# EAGLE design Traffic_Lights_schematic (EAGLE 8.4.3)
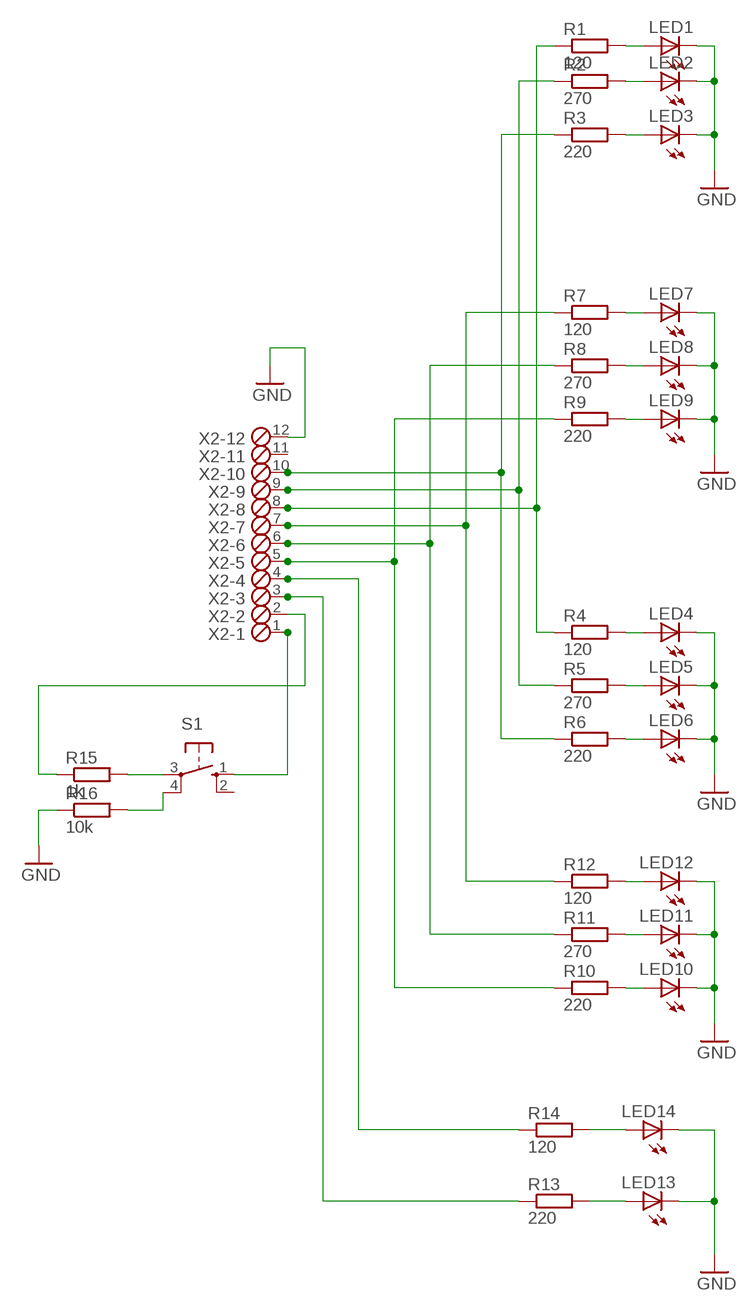
[diagram p0: schematic, sheet 1]

## Parts
LED1  LED5MM  [LED5MM]
LED2  LED5MM  [LED5MM]
LED3  LED5MM  [LED5MM]
LED4  LED5MM  [LED5MM]
LED5  LED5MM  [LED5MM]
LED6  LED5MM  [LED5MM]
LED7  LED5MM  [LED5MM]
LED8  LED5MM  [LED5MM]
LED9  LED5MM  [LED5MM]
LED10  LED5MM  [LED5MM]
LED11  LED5MM  [LED5MM]
LED12  LED5MM  [LED5MM]
LED13  LED5MM  [LED5MM]
LED14  LED5MM  [LED5MM]
R1  120  R-EU_0207/7  [0207/7]
R2  270  R-EU_0207/7  [0207/7]
R3  220  R-EU_0207/7  [0207/7]
R4  120  R-EU_0207/7  [0207/7]
R5  270  R-EU_0207/7  [0207/7]
R6  220  R-EU_0207/7  [0207/7]
R7  120  R-EU_0207/7  [0207/7]
R8  270  R-EU_0207/7  [0207/7]
R9  220  R-EU_0207/7  [0207/7]
R10  220  R-EU_0207/7  [0207/7]
R11  270  R-EU_0207/7  [0207/7]
R12  120  R-EU_0207/7  [0207/7]
R13  220  R-EU_0207/7  [0207/7]
R14  120  R-EU_0207/7  [0207/7]
R15  1k  R-EU_0207/7  [0207/7]
R16  10k  R-EU_0207/7  [0207/7]
S1  10-XX  [B3F-10XX]
X2  MPT12  [12POL254]

## Nets
GND: LED1.K(C) LED2.K(C) LED3.K(C) LED4.K(C) LED5.K(C) LED6.K(C) LED7.K(C) LED8.K(C) LED9.K(C) LED10.K(C) LED11.K(C) LED12.K(C) LED13.K(C) LED14.K(C) R16.1 X2.12
N$1: LED1.A R1.2
N$2: LED2.A R2.2
N$3: LED3.A R3.2
N$4: LED7.A R7.2
N$5: LED8.A R8.2
N$6: LED9.A R9.2
N$7: LED4.A R4.2
N$8: LED5.A R5.2
N$9: LED6.A R6.2
N$10: LED12.A R12.2
N$11: LED11.A R11.2
N$12: LED10.A R10.2
N$13: R1.1 R4.1 X2.8
N$14: R2.1 R5.1 X2.9
N$15: R3.1 R6.1 X2.10
N$16: R7.1 R12.1 X2.7
N$17: LED14.A R14.2
N$18: R8.1 R11.1 X2.6
N$19: R9.1 R10.1 X2.5
N$20: LED13.A R13.2
N$21: R14.1 X2.4
N$22: R13.1 X2.3
N$23: R15.2 S1.3(P)
N$24: R16.2 S1.4(P1)
N$25: R15.1 X2.2
N$26: S1.1(S) X2.1
Unconnected: S1.2(S1) X2.11

## Library data of the parts
LED1-LED14 = led:LED: LED OSRAM: - CHIPLED LG R971, LG N971, LY N971, LG Q971, LY Q971, LO R971, LY R971 LH N974, LH R974 LS Q976, LO Q976, LY Q976 LO Q996 - Hyper CHIPLED LW Q18S LB Q993, LB Q99A, LB R99A - SideLED LS A670, LO A670, LY A670, LG A670, LP A670 LB A673, LV A673, LT A673, LW A673 LH A674 LY A675 LS A676, LA A676, LO A676, LY A676, LW A676 LS A679, LY A679, LG A679 - Hyper Micro SIDELED® LS Y876, LA Y876, LO Y876, LY Y876 LT Y87S - SmartLED LW L88C, LW L88S LB L89C, LB L89S, LG L890 LS L89K, LO L89K, LY L89K LS L896, LA L896, LO L896, LY L896 - TOPLED LS T670, LO T670, LY T670, LG T670, LP T670 LSG T670, LSP T670, LSY T670, LOP T670, LYG T670 LG T671, LOG T671, LSG T671 LB T673, LV T673, LT T673, LW T673 LH T674 LS T676, LA T676, LO T676, LY T676, LB T676, LH T676, LSB T676, LW T676 LB T67C, LV T67C, LT T67C, LS T67K, LO T67K, LY T67K, LW E67C LS E67B, LA E67B, LO E67B, LY E67B, LB E67C, LV E67C, LT E67C LW T67C LS T679, LY T679, LG T679 LS T770, LO T770, LY T770, LG T770, LP T770 LB T773, LV T773, LT T773, LW T773 LH T774 LS E675, LA E675, LY E675, LS T675 LS T776, LA T776, LO T776, LY T776, LB T776 LHGB T686 LT T68C, LB T68C - Hyper Mini TOPLED® LB M676 - Mini TOPLED Santana® LG M470 LS M47K, LO M47K, LY M47K Source: http://www.osram.convergy.de LUXEON: - LUMILED® LXK2-PW12-R00, LXK2-PW12-S00, LXK2-PW14-U00, LXK2-PW14-V00 LXK2-PM12-R00, LXK2-PM12-S00, LXK2-PM14-U00 LXK2-PE12-Q00, LXK2-PE12-R00, LXK2-PE12-S00, LXK2-PE14-T00, LXK2-PE14-U00 LXK2-PB12-K00, LXK2-PB12-L00, LXK2-PB12-M00, LXK2-PB14-N00, LXK2-PB14-P00, LXK2-PB14-Q00 LXK2-PR12-L00, LXK2-PR12-M00, LXK2-PR14-Q00, LXK2-PR14-R00 LXK2-PD12-Q00, LXK2-PD12-R00, LXK2-PD12-S00 LXK2-PH12-R00, LXK2-PH12-S00 LXK2-PL12-P00, LXK2-PL12-Q00, LXK2-PL12-R00 Source: www.luxeon.com KINGBRIGHT: KA-3528ASYC Source: www.kingbright.com
R1-R16 = rcl:R-EU_: RESISTOR, European symbol
S1 = switch-omron:10-XX: OMRON SWITCH; MPN: B3F-1000; OC_FARNELL: 176432; OC_NEWARK: 36M3542
X2 = con-phoenix-254:MPT12: PHOENIX CONNECTOR; OC_FARNELL: unknown; OC_NEWARK: unknown

## Board
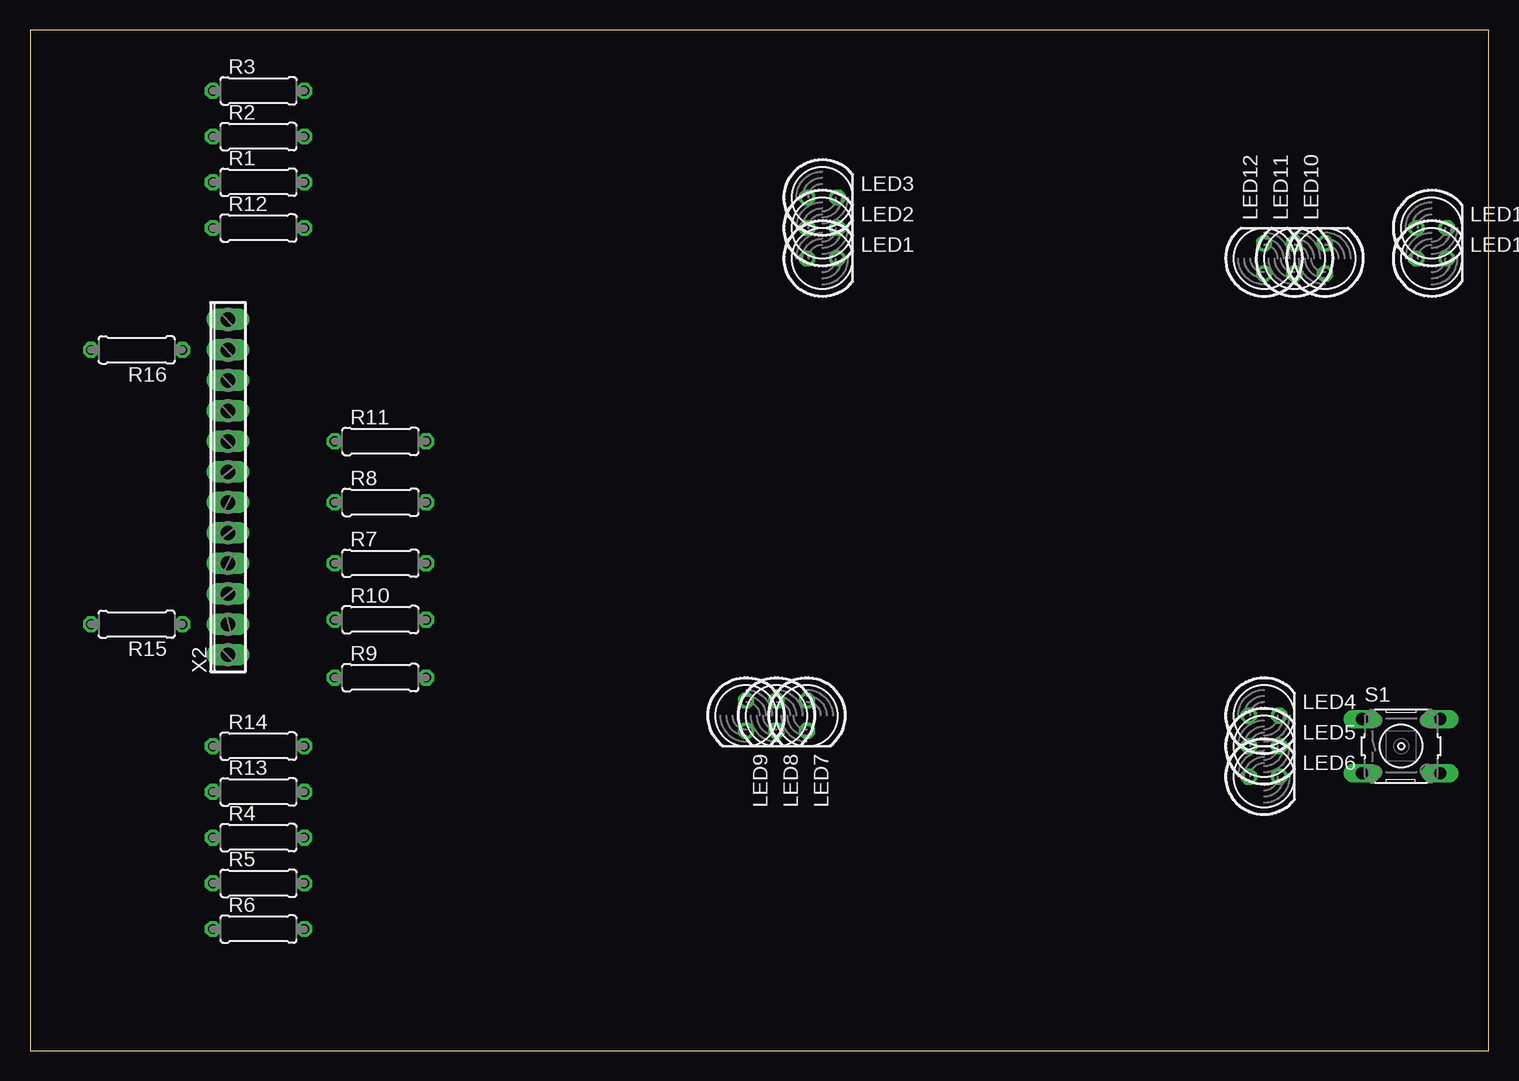
[diagram p1: board, top side]
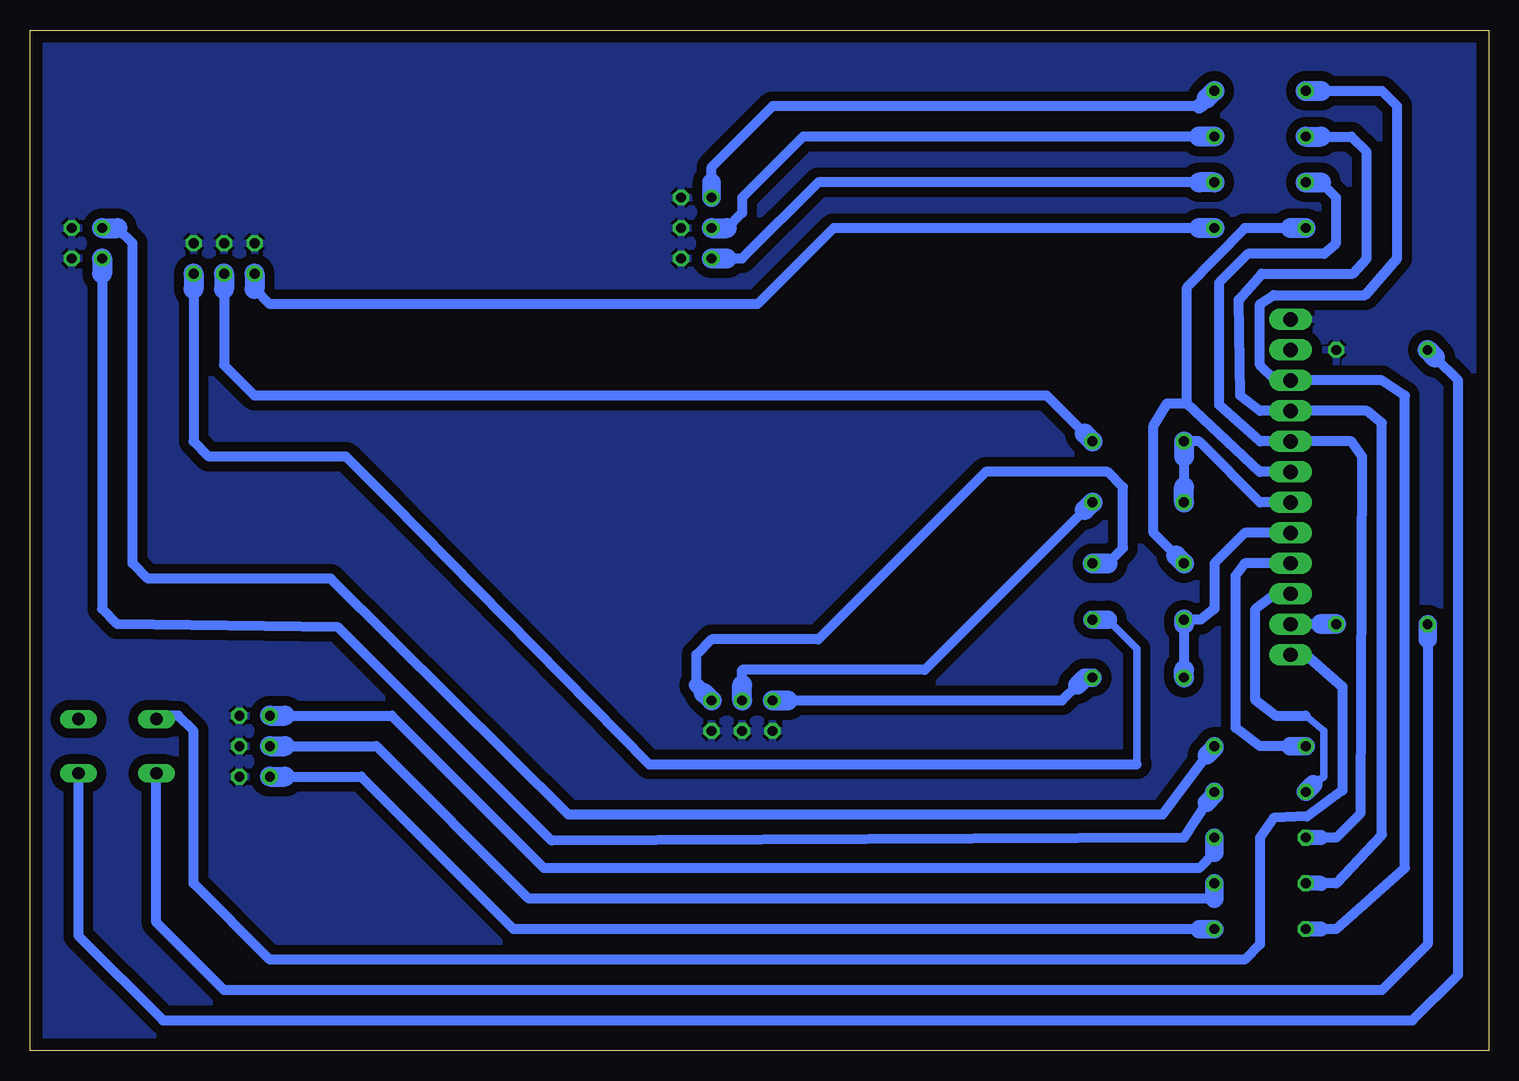
[diagram p2: board, bottom side, seen from below]

Size 121.59 x 85.08 mm. Coordinates in mm from the lower left corner, seen from the top.
Outline: 0,0 121.59,0 121.59,85.08 0,85.08 0,0
Copper layers (1*16): Top 0.035mm / dielectric 1.5mm / Bottom 0.035mm
Design rules "default *": minimum track width 6mil, minimum drill 0.35mm, track to track 6mil, track to pad 6mil, pad to pad 6mil, via to via 6mil, smd to smd 6mil, copper to edge 40mil, drill to drill 6mil, minimum pad ring 10mil, minimum via ring 8mil, stop-mask expansion 4mil, vias tented up to drill 0mil, thermal gap 10mil

### Footprints (pad centres in the part's own frame; a part is rotated, then mirrored left to right if it is on the bottom)
LED5MM = drill 0.813 octagon: A -1.27,0; K 1.27,0
0207/7 = drill 0.813 octagon: 1 -3.81,0; 2 3.81,0
B3F-10XX = drill 1.016 long: 1 -3.251,2.261; 2 3.251,2.261; 3 -3.251,-2.261; 4 3.251,-2.261
12POL254 = drill 1.2 long: 1 -13.97,0; 2 -11.43,0; 3 -8.89,0; 4 -6.35,0; 5 -3.81,0; 6 -1.27,0; 7 1.27,0; 8 3.81,0; 9 6.35,0; 10 8.89,0; 11 11.43,0; 12 13.97,0

### Placement (x,y rotation side)
LED1  66.04,66.04 0 top
LED2  66.04,68.58 0 top
LED3  66.04,71.12 0 top
LED4  102.87,27.94 0 top
LED5  102.87,25.4 0 top
LED6  102.87,22.86 0 top
LED7  64.77,27.94 270 top
LED8  62.23,27.94 270 top
LED9  59.69,27.94 270 top
LED10  107.95,66.04 90 top
LED11  105.41,66.04 90 top
LED12  102.87,66.04 90 top
LED13  116.84,66.04 0 top
LED14  116.84,68.58 0 top
R1  19.05,72.39 0 top
R2  19.05,76.2 0 top
R3  19.05,80.01 0 top
R4  19.05,17.78 0 top
R5  19.05,13.97 0 top
R6  19.05,10.16 0 top
R7  29.21,40.64 0 top
R8  29.21,45.72 0 top
R9  29.21,31.11 0 top
R10  29.21,35.94 0 top
R11  29.21,50.8 0 top
R12  19.05,68.58 0 top
R13  19.05,21.59 0 top
R14  19.05,25.4 0 top
R15  8.89,35.56 180 top
R16  8.89,58.42 180 top
S1  114.3,25.4 0 top
X2  16.51,46.99 90 top

### Tracks (layer width: path | path; a pad name or v marks a point on that pad's centre or on a via)
GND
  pour Bottom (isolate 0.813): -2.54,85.09 -2.54,-2.54 124.46,-2.54 124.46,85.09
N$1
  Bottom 0.813: 24.13,72.39 55.88,72.39 62.23,66.04 63.5,66.04
  Bottom 1.651: R1.2 24.13,72.39 | LED1.A 63.5,66.04
N$2
  Bottom 0.813: 24.13,76.2 57.15,76.2 62.23,71.12 62.23,69.85 63.5,68.58
  Bottom 1.651: R2.2 24.13,76.2 | LED2.A 63.5,68.58
N$3
  Bottom 0.813: 64.77,72.39 64.77,73.66 59.69,78.74 24.13,78.74
  Bottom 1.27: 23.5,79.38 24.13,78.74
  Bottom 1.524: LED3.A 64.77,72.39
  Bottom 1.651: R3.2 23.5,79.38
N$4
  Bottom 0.813: 31.75,40.64 30.48,41.91 30.48,46.99 31.75,48.26 41.91,48.26 55.88,34.29 64.77,34.29 66.04,33.02 66.04,30.48
  Bottom 1.27: 65.41,29.84 66.04,30.48
  Bottom 1.651: LED7.A 65.41,29.84 | R7.2 31.75,40.64
N$5
  Bottom 0.813: 33.66,45.09 46.99,31.75 62.23,31.75 62.23,30.48
  Bottom 1.651: LED8.A 62.23,30.48 | R8.2 33.66,45.09
N$6
  Bottom 0.813: 34.29,30.48 35.56,29.21 58.42,29.21
  Bottom 1.524: R9.2 33.66,31.11 34.29,30.48
  Bottom 1.651: LED9.A 58.42,29.21
N$7
  Bottom 0.813: 100.33,27.94 91.44,27.94 78.74,15.24 24.13,15.24 22.86,16.51
  Bottom 1.524: R4.2 22.86,16.51
  Bottom 1.651: LED4.A 100.33,27.94
N$8
  Bottom 0.813: 22.86,12.7 80.01,12.7 92.71,25.4 100.33,25.4
  Bottom 1.524: R5.2 22.86,12.7
  Bottom 1.651: LED5.A 100.33,25.4
N$9
  Bottom 0.813: 24.13,10.16 81.28,10.16 93.98,22.86 100.33,22.86
  Bottom 1.524: R6.2 24.13,10.16
  Bottom 1.651: LED6.A 100.33,22.86
N$10
  Bottom 0.813: 24.13,68.58 54.61,68.58 60.96,62.23 101.6,62.23 102.87,63.5
  Bottom 1.651: R12.2 24.13,68.58 | LED12.A 102.87,63.5
N$11
  Bottom 0.813: 33.66,51.44 36.83,54.61 102.87,54.61 105.41,57.15 105.41,63.5
  Bottom 1.651: LED11.A 105.41,63.5 | R11.2 33.66,51.44
N$12
  Bottom 0.61: 31.75,35.94 29.34,33.53 29.34,23.88
  Bottom 0.813: 29.34,23.88 69.98,23.88 91.44,45.72 95.25,49.53 106.68,49.53 107.95,50.8 107.95,63.5
  Bottom 1.27: 31.75,35.94 31.62,35.94
  Bottom 1.524: R10.2 31.75,35.94
  Bottom 1.651: LED10.A 107.95,63.5
N$13
  Bottom 0.813: 13.97,72.39 12.7,71.12 12.7,67.31 13.72,66.42 20.07,66.42 22.48,64.01 22.48,53.85 19.05,50.8 X2.8 11.43,50.8 10.54,49.53 10.67,19.81 12.7,17.78 13.97,17.78
  Bottom 1.27: 13.97,17.78 R4.1
  Bottom 1.651: R1.1 13.97,72.39
N$14
  Bottom 0.813: 13.97,13.97 12.7,13.97 8.89,18.03 8.89,52.32 10.16,53.34 X2.9 19.05,53.34 20.7,54.61 20.83,62.61 18.92,64.77 11.3,64.77 10.16,66.04 10.16,74.93 11.43,76.2 13.97,76.2
  Bottom 1.27: 13.97,13.97 R5.1
  Bottom 1.651: R2.1 13.97,76.2
N$15
  Bottom 0.813: 13.97,10.16 12.7,10.16 6.98,15.24 6.98,54.61 8.89,55.88 X2.10 17.78,55.88 19.05,57.15 19.05,62.23 17.91,62.99 10.29,62.99 7.62,66.04 7.62,78.74 8.89,80.01 13.97,80.01
  Bottom 1.27: 13.97,10.16 R6.1
  Bottom 1.651: R3.1 13.97,80.01
N$16
  Bottom 0.813: 25.15,53.98 25.15,63.63 20.32,68.58 16.51,68.58 | X2.7 19.05,48.26 25.15,53.98 | 25.15,53.98 26.8,53.98 27.94,52.07 27.94,43.18 26.04,41.28
  Bottom 1.651: R7.1 26.04,41.28 | R12.1 16.51,68.58
N$17
  Bottom 0.813: 23.5,24.64 27.18,19.68 76.71,19.68 91.44,34.29 96.52,39.37 111.76,39.37 113.03,40.64 113.03,67.31 114.3,68.58
  Bottom 1.524: R14.2 22.86,25.27 23.5,24.64
  Bottom 1.651: LED14.A 114.3,68.58
N$18
  Bottom 0.813: X2.6 19.05,45.72 24.13,50.8 R11.1 | 25.4,49.53 25.4,46.99
  Bottom 1.651: R8.1 25.4,46.99 | R11.1 25.4,49.53
N$19
  Bottom 0.813: X2.5 20.32,43.18 22.86,40.64 22.86,36.83 24,35.94 R10.1 | 25.4,35.56 25.4,31.75
  Bottom 1.651: R9.1 25.4,31.75 | R10.1 25.4,35.56
N$20
  Bottom 0.813: 23.5,20.7 25.4,17.78 78.11,17.53 95.88,35.31 114.3,35.56 115.57,36.83 115.57,64.77
  Bottom 1.524: R13.2 22.86,21.34 23.5,20.7
  Bottom 1.651: LED13.A 115.57,64.77
N$21
  Bottom 0.813: 16.51,25.4 19.05,25.4 21.08,26.92 21.08,39.62 20.32,40.64 X2.4
  Bottom 1.524: R14.1 16.51,25.4
N$22
  Bottom 0.61: 15.24,27.94 13.72,26.67 13.72,22.86 14.61,22.22
  Bottom 0.813: 15.24,27.94 17.78,27.94 19.43,29.21 19.43,36.83 17.78,38.1 X2.3
  Bottom 1.524: R13.1 14.61,22.22
N$23
  Bottom 0.813: 5.08,34.29 5.08,8.89 8.89,5.08 105.41,5.08 111.05,10.72 S1.3
  Bottom 1.524: R15.2 5.08,34.29
N$24
  Bottom 0.813: S1.4 117.55,9.6 110.49,2.54 6.35,2.54 2.54,6.35 2.54,55.88 4.45,57.79
  Bottom 1.651: R16.2 4.45,57.79
N$25
  Bottom 0.813: 13.97,35.56 X2.2
  Bottom 1.651: R15.1 13.97,35.56
N$26
  Bottom 0.813: X2.1 15.24,33.02 12.19,30.35 12.19,21.72 15.11,19.56 17.91,19.43 19.05,17.78 19.05,8.89 20.32,7.62 101.6,7.62 107.95,13.97 107.95,26.67 109.22,27.94 110.77,27.94 S1.1